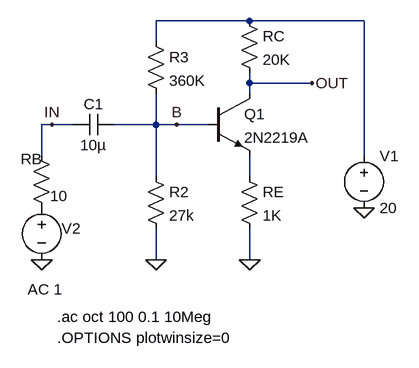
[diagram p0: schematic Fig_6-24_1_Tr_Amp_AC.asc]
Fig_6-24_1_Tr_Amp_AC.asc, the LTspice schematic file:
Version 4
SHEET 1 880 680
WIRE 192 64 48 64
WIRE 368 64 192 64
WIRE 48 96 48 64
WIRE 192 160 192 144
WIRE 288 160 192 160
WIRE 192 176 192 160
WIRE -112 224 -128 224
WIRE -80 224 -112 224
WIRE 48 224 48 176
WIRE 48 224 -16 224
WIRE 80 224 48 224
WIRE 128 224 80 224
WIRE -128 272 -128 224
WIRE 368 272 368 64
WIRE 48 304 48 224
WIRE 192 304 192 272
WIRE 48 432 48 384
WIRE 192 432 192 384
FLAG 192 432 0
FLAG -128 432 0
FLAG 368 352 0
FLAG 288 160 OUT
FLAG -112 224 IN
FLAG 48 432 0
FLAG 80 224 B
SYMBOL npn 128 176 R0
SYMATTR InstName Q1
SYMATTR Value 2N2219A
SYMBOL res 176 48 R0
SYMATTR InstName RC
SYMATTR Value 20K
SYMBOL res 176 288 R0
SYMATTR InstName RE
SYMATTR Value 1K
SYMBOL voltage 368 256 R0
WINDOW 123 0 0 Left 2
WINDOW 39 0 0 Left 2
SYMATTR InstName V1
SYMATTR Value 20
SYMBOL voltage -128 336 R0
WINDOW 123 -21 142 Left 2
WINDOW 39 0 0 Left 2
WINDOW 0 31 48 Left 2
WINDOW 3 -13 134 Left 2
SYMATTR Value2 AC 1
SYMATTR InstName V2
SYMATTR Value ""
SYMBOL res -144 256 R0
WINDOW 0 -16 21 Left 2
WINDOW 3 29 78 Left 2
SYMATTR InstName RB
SYMATTR Value 10
SYMBOL res 32 80 R0
SYMATTR InstName R3
SYMATTR Value 360K
SYMBOL res 32 288 R0
SYMATTR InstName R2
SYMATTR Value 27k
SYMBOL cap -80 240 R270
WINDOW 0 32 32 VTop 2
WINDOW 3 0 32 VBottom 2
SYMATTR InstName C1
SYMATTR Value 10µ
TEXT -104 520 Left 2 !.ac oct 100 0.1 10Meg
TEXT -104 552 Left 2 !.OPTIONS plotwinsize=0

The netlist it stands for:
* Fig_6-24_1_Tr_Amp_AC.asc
Q1 OUT B N002 0 2N2219A
RC N001 OUT 20K
RE N002 0 1K
V1 N001 0 20
V2 P001 0 AC 1
RB IN P001 10
R3 N001 B 360K
R2 B 0 27k
C1 IN B 10µ
.model NPN NPN
.model PNP PNP
.lib standard.bjt
.ac oct 100 0.1 10Meg
.OPTIONS plotwinsize=0
.backanno
.end